# Altium schematic sheet S07_PCIe_Connector.SchDoc: PCIe Connector
size 381 x 241 mm; SheetNumber: 7; SheetTotal: 12
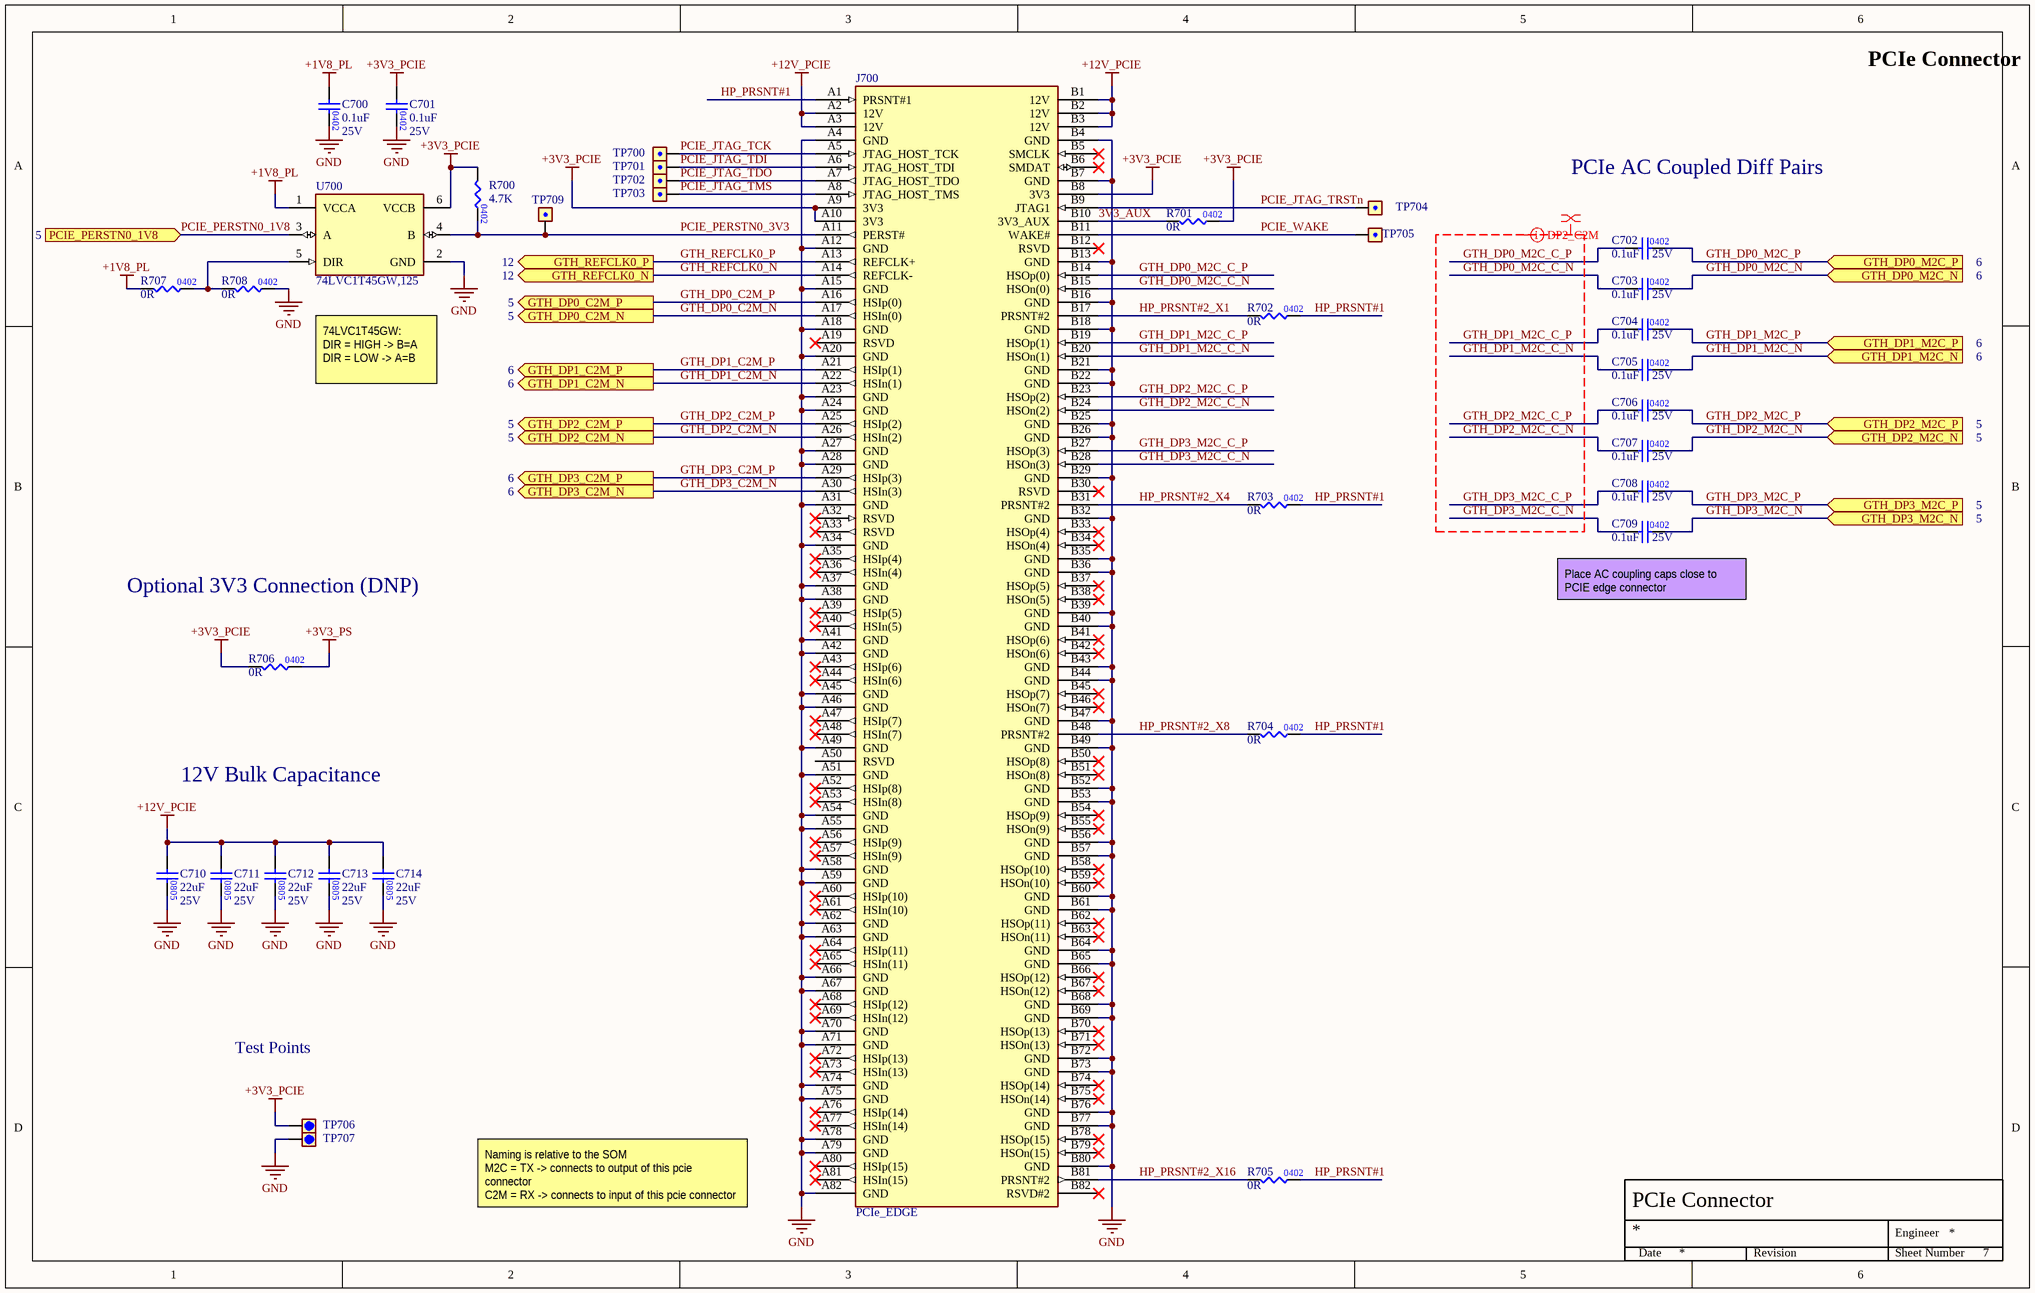
[diagram p0: S07_PCIe_Connector.SchDoc]

## Parts
C700  value 0.1uF  Voltage Rating: 25V  [CAP0402]  (hidden comment: CAP_0402)
C701  value 0.1uF  Voltage Rating: 25V  [CAP0402]  (hidden comment: CAP_0402)
C702  value 0.1uF  Voltage Rating: 25V  [CAP0402]  (hidden comment: CAP_0402)
C703  value 0.1uF  Voltage Rating: 25V  [CAP0402]  (hidden comment: CAP_0402)
C704  value 0.1uF  Voltage Rating: 25V  [CAP0402]  (hidden comment: CAP_0402)
C705  value 0.1uF  Voltage Rating: 25V  [CAP0402]  (hidden comment: CAP_0402)
C706  value 0.1uF  Voltage Rating: 25V  [CAP0402]  (hidden comment: CAP_0402)
C707  value 0.1uF  Voltage Rating: 25V  [CAP0402]  (hidden comment: CAP_0402)
C708  value 0.1uF  Voltage Rating: 25V  [CAP0402]  (hidden comment: CAP_0402)
C709  value 0.1uF  Voltage Rating: 25V  [CAP0402]  (hidden comment: CAP_0402)
C710  value 22uF  Voltage Rating: 25V  [CAP0805]  (hidden comment: CAP_0805)
C711  value 22uF  Voltage Rating: 25V  [CAP0805]  (hidden comment: CAP_0805)
C712  value 22uF  Voltage Rating: 25V  [CAP0805]  (hidden comment: CAP_0805)
C713  value 22uF  Voltage Rating: 25V  [CAP0805]  (hidden comment: CAP_0805)
C714  value 22uF  Voltage Rating: 25V  [CAP0805]  (hidden comment: CAP_0805)
J700  PCIe_EDGE  [PCIe]
R700  Resistance: 4.7K  [RES0402]  (hidden comment: RES_0402)
R701  Resistance: 0R  [RES0402]  (hidden comment: RES_0402)
R702  Resistance: 0R  [RES0402]  (hidden comment: RES_0402)
R703  Resistance: 0R  [RES0402]  (hidden comment: RES_0402)
R704  Resistance: 0R  [RES0402]  (hidden comment: RES_0402)
R705  Resistance: 0R  [RES0402]  (hidden comment: RES_0402)
R706  Resistance: 0R  [RES0402]  (hidden comment: RES_0402)
R707  Resistance: 0R  [RES0402]  (hidden comment: RES_0402)
R708  Resistance: 0R  [RES0402]  (hidden comment: RES_0402)
TP700  1mm Round Pad Testpoint  [TP_1MM]  (value not drawn)
TP701  1mm Round Pad Testpoint  [TP_1MM]  (value not drawn)
TP702  1mm Round Pad Testpoint  [TP_1MM]  (value not drawn)
TP703  1mm Round Pad Testpoint  [TP_1MM]  (value not drawn)
TP704  1mm Round Pad Testpoint  [TP_1MM]  (value not drawn)
TP705  1mm Round Pad Testpoint  [TP_1MM]  (value not drawn)
TP706  2mm Round Pad Testpoint  [TP_2MM]  (value not drawn)
TP707  2mm Round Pad Testpoint  [TP_2MM]  (value not drawn)
TP709  1mm Round Pad Testpoint  [TP_1MM]  (value not drawn)
U700  74LVC1T45GW,125  [NEXPERIA_TSSOP6]

## Ports
GTH_DP0_C2M_N (out, see 5), GTH_DP0_C2M_P (out, see 5), GTH_DP0_M2C_N (in, see 6), GTH_DP0_M2C_P (in, see 6), GTH_DP1_C2M_N (out, see 6), GTH_DP1_C2M_P (out, see 6), GTH_DP1_M2C_N (in, see 6), GTH_DP1_M2C_P (in, see 6), GTH_DP2_C2M_N (out, see 5), GTH_DP2_C2M_P (out, see 5), GTH_DP2_M2C_N (in, see 5), GTH_DP2_M2C_P (in, see 5), GTH_DP3_C2M_N (out, see 6), GTH_DP3_C2M_P (out, see 6), GTH_DP3_M2C_N (in, see 5), GTH_DP3_M2C_P (in, see 5), GTH_REFCLK0_N (out, see 12), GTH_REFCLK0_P (out, see 12), PCIE_PERSTN0_1V8 (in, see 5)

## Nets
+1V8_PL: C700.1 R707.1 U700.1(VCCA)
+3V3_PCIE: C701.1 J700.A9(3V3) J700.A10(3V3) J700.B8(3V3) R700.1 R701.2 R706.1 TP706.1 U700.6(VCCB)
+3V3_PS: R706.2
+12V_PCIE: C710.1 C711.1 C712.1 C713.1 C714.1 J700.A2(12V) J700.A3(12V) J700.B1(12V) J700.B2(12V) J700.B3(12V)
GND: C700.2 C701.2 C710.2 C711.2 C712.2 C713.2 C714.2 J700.A4(GND) J700.A12(GND) J700.A15(GND) J700.A18(GND) J700.A20(GND) J700.A23(GND) J700.A24(GND) J700.A27(GND) J700.A28(GND) J700.A31(GND) J700.A34(GND) J700.A37(GND) J700.A38(GND) J700.A41(GND) J700.A42(GND) J700.A45(GND) J700.A46(GND) J700.A49(GND) J700.A51(GND) J700.A54(GND) J700.A55(GND) J700.A58(GND) J700.A59(GND) J700.A62(GND) J700.A63(GND) J700.A66(GND) J700.A67(GND) J700.A70(GND) J700.A71(GND) J700.A74(GND) J700.A75(GND) J700.A78(GND) J700.A79(GND) J700.A82(GND) J700.B4(GND) J700.B7(GND) J700.B13(GND) J700.B16(GND) J700.B18(GND) J700.B21(GND) J700.B22(GND) J700.B25(GND) J700.B26(GND) J700.B29(GND) J700.B32(GND) J700.B35(GND) J700.B36(GND) J700.B39(GND) J700.B40(GND) J700.B43(GND) J700.B44(GND) J700.B47(GND) J700.B49(GND) J700.B52(GND) J700.B53(GND) J700.B56(GND) J700.B57(GND) J700.B60(GND) J700.B61(GND) J700.B64(GND) J700.B65(GND) J700.B68(GND) J700.B69(GND) J700.B72(GND) J700.B73(GND) J700.B76(GND) J700.B77(GND) J700.B80(GND) R708.2 TP707.1 U700.2(GND)
3V3_AUX: J700.B10(3V3_AUX) R701.1
GTH_DP0_C2M_N: J700.A17(HSIn(0)) ; port GTH_DP0_C2M_N
GTH_DP0_C2M_P: J700.A16(HSIp(0)) ; port GTH_DP0_C2M_P
GTH_DP0_M2C_C_N: C703.1 J700.B15(HSOn(0))
GTH_DP0_M2C_C_P: C702.1 J700.B14(HSOp(0))
GTH_DP0_M2C_N: C703.2 ; port GTH_DP0_M2C_N
GTH_DP0_M2C_P: C702.2 ; port GTH_DP0_M2C_P
GTH_DP1_C2M_N: J700.A22(HSIn(1)) ; port GTH_DP1_C2M_N
GTH_DP1_C2M_P: J700.A21(HSIp(1)) ; port GTH_DP1_C2M_P
GTH_DP1_M2C_C_N: C705.1 J700.B20(HSOn(1))
GTH_DP1_M2C_C_P: C704.1 J700.B19(HSOp(1))
GTH_DP1_M2C_N: C705.2 ; port GTH_DP1_M2C_N
GTH_DP1_M2C_P: C704.2 ; port GTH_DP1_M2C_P
GTH_DP2_C2M_N: J700.A26(HSIn(2)) ; port GTH_DP2_C2M_N
GTH_DP2_C2M_P: J700.A25(HSIp(2)) ; port GTH_DP2_C2M_P
GTH_DP2_M2C_C_N: C707.1 J700.B24(HSOn(2))
GTH_DP2_M2C_C_P: C706.1 J700.B23(HSOp(2))
GTH_DP2_M2C_N: C707.2 ; port GTH_DP2_M2C_N
GTH_DP2_M2C_P: C706.2 ; port GTH_DP2_M2C_P
GTH_DP3_C2M_N: J700.A30(HSIn(3)) ; port GTH_DP3_C2M_N
GTH_DP3_C2M_P: J700.A29(HSIp(3)) ; port GTH_DP3_C2M_P
GTH_DP3_M2C_C_N: C709.1 J700.B28(HSOn(3))
GTH_DP3_M2C_C_P: C708.1 J700.B27(HSOp(3))
GTH_DP3_M2C_N: C709.2 ; port GTH_DP3_M2C_N
GTH_DP3_M2C_P: C708.2 ; port GTH_DP3_M2C_P
GTH_REFCLK0_N: J700.A14(REFCLK-) ; port GTH_REFCLK0_N
GTH_REFCLK0_P: J700.A13(REFCLK+) ; port GTH_REFCLK0_P
HP_PRSNT#1: J700.A1(PRSNT#1) R702.2 R703.2 R704.2 R705.2
HP_PRSNT#2_X1: J700.B17(PRSNT#2) R702.1
HP_PRSNT#2_X4: J700.B31(PRSNT#2) R703.1
HP_PRSNT#2_X8: J700.B48(PRSNT#2) R704.1
HP_PRSNT#2_X16: J700.B81(PRSNT#2) R705.1
PCIE_JTAG_TCK: J700.A5(JTAG_HOST_TCK) TP700.1
PCIE_JTAG_TDI: J700.A6(JTAG_HOST_TDI) TP701.1
PCIE_JTAG_TDO: J700.A7(JTAG_HOST_TDO) TP702.1
PCIE_JTAG_TMS: J700.A8(JTAG_HOST_TMS) TP703.1
PCIE_JTAG_TRSTn: J700.B9(JTAG1) TP704.1
PCIE_PERSTN0_1V8: U700.3(A) ; port PCIE_PERSTN0_1V8
PCIE_PERSTN0_3V3: J700.A11(PERST#) R700.2 TP709.1 U700.4(B)
PCIE_WAKE: J700.B11(WAKE#) TP705.1
NetR707_2: R707.2 R708.1 U700.5(DIR)

Not connected (* = marked no-connect by the designer): J700 A19(RSVD)* A32(RSVD)* A33(RSVD)* A35(HSIp(4))* A36(HSIn(4))* A39(HSIp(5))* A40(HSIn(5))* A43(HSIp(6))* A44(HSIn(6))* A47(HSIp(7))* A48(HSIn(7))* A50(RSVD) A52(HSIp(8))* A53(HSIn(8))* A56(HSIp(9))* A57(HSIn(9))* A60(HSIp(10))* A61(HSIn(10))* A64(HSIp(11))* A65(HSIn(11))* A68(HSIp(12))* A69(HSIn(12))* A72(HSIp(13))* A73(HSIn(13))* A76(HSIp(14))* A77(HSIn(14))* A80(HSIp(15))* A81(HSIn(15))* B5(SMCLK)* B6(SMDAT)* B12(RSVD)* B30(RSVD)* B33(HSOp(4))* B34(HSOn(4))* B37(HSOp(5))* B38(HSOn(5))* B41(HSOp(6))* B42(HSOn(6))* B45(HSOp(7))* B46(HSOn(7))* B50(HSOp(8))* B51(HSOn(8))* B54(HSOp(9))* B55(HSOn(9))* B58(HSOp(10))* B59(HSOn(10))* B62(HSOp(11))* B63(HSOn(11))* B66(HSOp(12))* B67(HSOn(12))* B70(HSOp(13))* B71(HSOn(13))* B74(HSOp(14))* B75(HSOn(14))* B78(HSOp(15))* B79(HSOn(15))* B82(RSVD#2)*

## Layout directives
differential pair; differential pair class DIFFPAIR90: GTH_DP0_M2C_C_N, GTH_DP0_M2C_C_P, GTH_DP1_M2C_C_N, GTH_DP1_M2C_C_P, GTH_DP2_M2C_C_N, GTH_DP2_M2C_C_P, GTH_DP3_M2C_C_N, GTH_DP3_M2C_C_P
net class DIFFPAIR_GTH: GTH_DP0_M2C_C_N, GTH_DP0_M2C_C_P, GTH_DP1_M2C_C_N, GTH_DP1_M2C_C_P, GTH_DP2_M2C_C_N, GTH_DP2_M2C_C_P, GTH_DP3_M2C_C_N, GTH_DP3_M2C_C_P

## Notes on the sheet
- PCIe AC Coupled Diff Pairs
- 74LVC1T45GW:
  DIR = HIGH -> B=A
  DIR = LOW -> A=B
- Optional 3V3 Connection (DNP)
- (near C709) Place AC coupling caps close to PCIE edge connector
- 12V Bulk Capacitance
- Test Points
- Naming is relative to the SOM
  M2C = TX -> connects to output of this pcie connector
  C2M = RX -> connects to input of this pcie connector
- Engineer
- Date
- Revision
- Sheet Number

## Library data of the parts
C700-C709 = CAP_CL05A104KA5NNNC: CAP CER 0.1UF 25V X5R 0402; Manufacturer: Samsung Electro-Mechanics; Tolerance: 10%; Manufacturer Part Number 1: CL05A104KA5NNNC; Case/Package: 0402; Mounting Type: Surface Mount; Temperature Coefficient: X5R
C710-C714 = CAP_CL21A226MAYNNNE: CAP CER 22UF 25V X5R 0805; Manufacturer: Samsung Electro-Mechanics; Tolerance: 20%; Manufacturer Part Number 1: CL21A226MAYNNNE; Case/Package: 0805; Mounting Type: Surface Mount; Temperature Coefficient: X5R
J700 = PCIe_EDGE: PCIe 3.3V x16
R700 = .RES_RC0402FR-074K7L: RES 4.7K OHM 1% 1/16W 0402; Manufacturer: YAGEO; Manufacturer Part Number: RC0402FR-074K7L; Case/Package: 0402; Tolerance: 1%
R701-R708 = .RES_RC0402JR-070RL: RES 0 OHM JUMPER 1/16W 0402; Manufacturer: YAGEO; Tolerance: 1%; Manufacturer Part Number: RC0402JR-070RL; Case/Package: 0402
TP700-TP705 TP709 = TP_1MM
TP706 TP707 = TP_2MM
U700 = 74LVC1T45GW,125: IC TRANSLTR BIDIRECTIONAL 6TSSOP